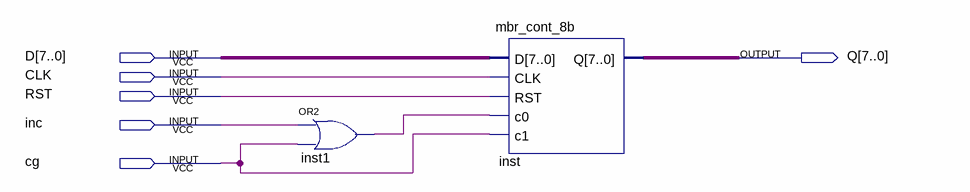
[diagram p0: schematic sheet]
// Quartus schematic mbr_pc.bdf as structural Verilog: 2 symbols, 6 pins
module mbr_pc (
  input  [7:0] D,
  input  CLK,
  input  RST,
  input  inc,
  input  cg,
  output [7:0] Q
);

  wire inst1_out;

  or inst1 (inst1_out, inc, cg);
  mbr_cont_8b inst (.D(D), .CLK(CLK), .RST(RST), .c0(inst1_out), .c1(cg), .Q(Q));
endmodule
